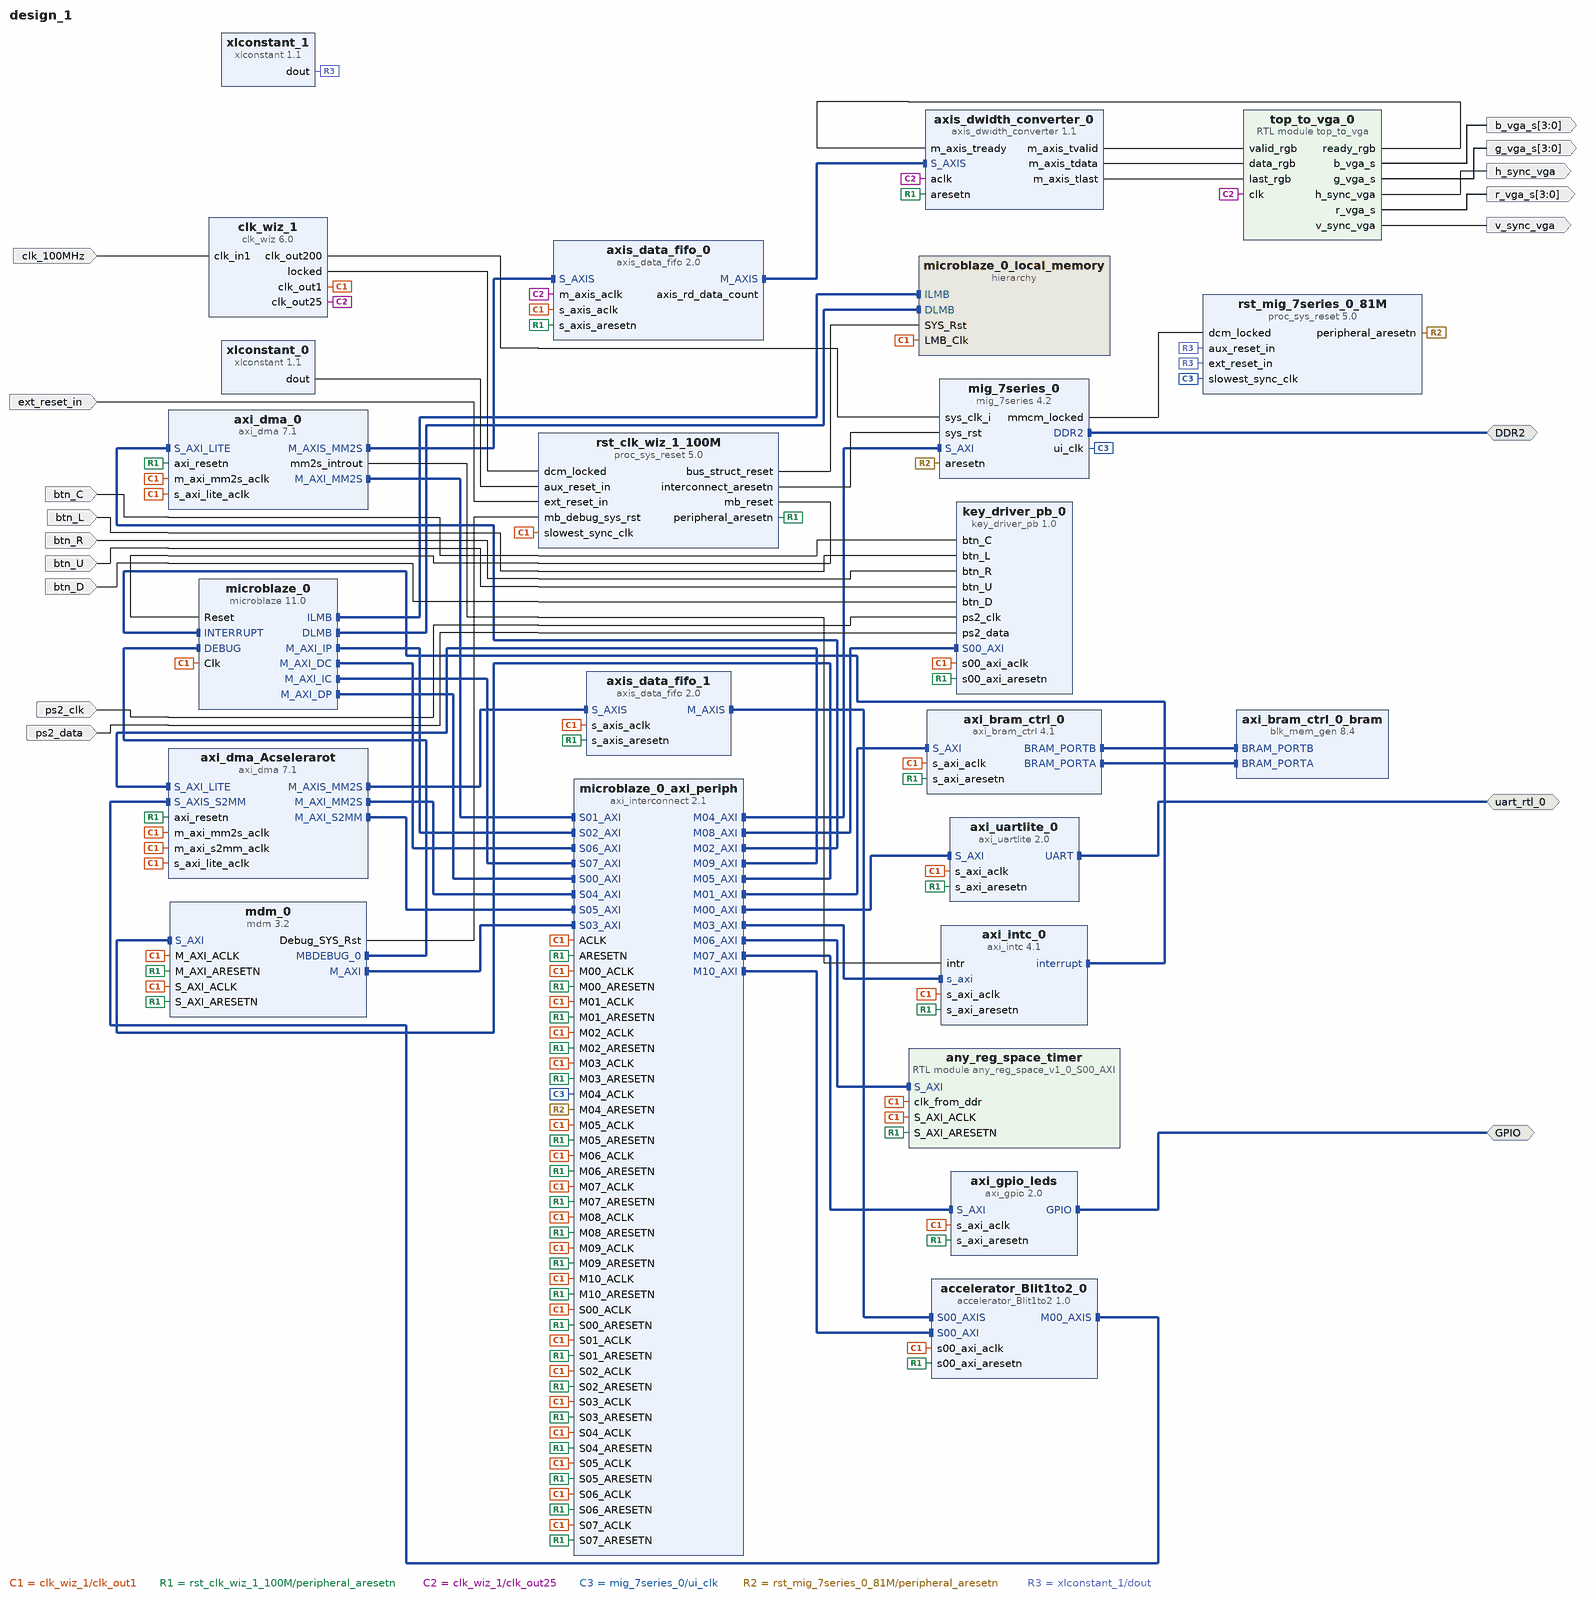
[diagram p0: block diagram of the top level]
# Vivado block design design_1, xc7a100tcsg324-1, Vivado 2019.1
create_bd_design design_1

create_bd_intf_port -mode Master -vlnv xilinx.com:interface:uart_rtl:1.0 uart_rtl_0
create_bd_intf_port -mode Master -vlnv xilinx.com:interface:ddrx_rtl:1.0 DDR2
create_bd_intf_port -mode Master -vlnv xilinx.com:interface:gpio_rtl:1.0 GPIO
create_bd_port -dir I -type clk clk_100MHz
set_property -dict {CONFIG.FREQ_HZ 100000000} [get_bd_ports clk_100MHz]
create_bd_port -dir O -from 3 -to 0 r_vga_s
create_bd_port -dir O -from 3 -to 0 g_vga_s
create_bd_port -dir O -from 3 -to 0 b_vga_s
create_bd_port -dir O v_sync_vga
create_bd_port -dir O h_sync_vga
create_bd_port -dir I -type rst ext_reset_in
create_bd_port -dir I btn_C
create_bd_port -dir I btn_L
create_bd_port -dir I btn_R
create_bd_port -dir I btn_U
create_bd_port -dir I btn_D
create_bd_port -dir I ps2_clk
create_bd_port -dir I ps2_data

create_bd_cell -type ip -vlnv xilinx.com:ip:microblaze:11.0 microblaze_0
set_property -dict [list \
  CONFIG.C_ADDR_TAG_BITS 15 \
  CONFIG.C_ALLOW_ICACHE_WR 1 \
  CONFIG.C_BRANCH_TARGET_CACHE_SIZE 0 \
  CONFIG.C_CACHE_BYTE_SIZE 4096 \
  CONFIG.C_DCACHE_ADDR_TAG 15 \
  CONFIG.C_DCACHE_BASEADDR 0x0000000080000000 \
  CONFIG.C_DCACHE_BYTE_SIZE 4096 \
  CONFIG.C_DCACHE_FORCE_TAG_LUTRAM 1 \
  CONFIG.C_DCACHE_HIGHADDR 0x0000000087FFFFFF \
  CONFIG.C_DCACHE_LINE_LEN 16 \
  CONFIG.C_DCACHE_USE_WRITEBACK 1 \
  CONFIG.C_DCACHE_VICTIMS 8 \
  CONFIG.C_DEBUG_ENABLED 1 \
  CONFIG.C_D_AXI 1 \
  CONFIG.C_D_LMB 1 \
  CONFIG.C_ICACHE_BASEADDR 0x0000000080000000 \
  CONFIG.C_ICACHE_FORCE_TAG_LUTRAM 1 \
  CONFIG.C_ICACHE_HIGHADDR 0x0000000087FFFFFF \
  CONFIG.C_ICACHE_LINE_LEN 16 \
  CONFIG.C_ICACHE_VICTIMS 8 \
  CONFIG.C_I_AXI 1 \
  CONFIG.C_I_LMB 1 \
  CONFIG.C_NUMBER_OF_PC_BRK 0 \
  CONFIG.C_USE_BARREL 1 \
  CONFIG.C_USE_BRANCH_TARGET_CACHE 0 \
  CONFIG.C_USE_DCACHE 1 \
  CONFIG.C_USE_DIV 1 \
  CONFIG.C_USE_FPU 1 \
  CONFIG.C_USE_HW_MUL 1 \
  CONFIG.C_USE_ICACHE 1 \
  CONFIG.C_USE_MSR_INSTR 1 \
  CONFIG.C_USE_PCMP_INSTR 1 \
] [get_bd_cells microblaze_0]
create_bd_cell -type hier microblaze_0_local_memory
create_bd_cell -type ip -vlnv xilinx.com:ip:clk_wiz:6.0 clk_wiz_1
set_property -dict [list \
  CONFIG.CLKOUT1_JITTER 145.728 \
  CONFIG.CLKOUT1_PHASE_ERROR 132.063 \
  CONFIG.CLKOUT1_REQUESTED_OUT_FREQ 120.000 \
  CONFIG.CLKOUT2_JITTER 200.470 \
  CONFIG.CLKOUT2_PHASE_ERROR 132.063 \
  CONFIG.CLKOUT2_REQUESTED_OUT_FREQ 25.000 \
  CONFIG.CLKOUT2_USED true \
  CONFIG.CLKOUT3_JITTER 132.221 \
  CONFIG.CLKOUT3_PHASE_ERROR 132.063 \
  CONFIG.CLKOUT3_REQUESTED_OUT_FREQ 200.000 \
  CONFIG.CLKOUT3_USED true \
  CONFIG.CLKOUT4_JITTER 151.366 \
  CONFIG.CLKOUT4_PHASE_ERROR 132.063 \
  CONFIG.CLKOUT4_USED true \
  CONFIG.CLK_OUT2_PORT clk_out25 \
  CONFIG.CLK_OUT3_PORT clk_out200 \
  CONFIG.CLK_OUT4_PORT clk_out100 \
  CONFIG.MMCM_CLKFBOUT_MULT_F 6.000 \
  CONFIG.MMCM_CLKIN1_PERIOD 10.0 \
  CONFIG.MMCM_CLKIN2_PERIOD 10.0 \
  CONFIG.MMCM_CLKOUT0_DIVIDE_F 5.000 \
  CONFIG.MMCM_CLKOUT1_DIVIDE 24 \
  CONFIG.MMCM_CLKOUT2_DIVIDE 3 \
  CONFIG.MMCM_CLKOUT3_DIVIDE 6 \
  CONFIG.NUM_OUT_CLKS 4 \
  CONFIG.PRIM_SOURCE Single_ended_clock_capable_pin \
  CONFIG.USE_LOCKED true \
  CONFIG.USE_RESET false \
] [get_bd_cells clk_wiz_1]
create_bd_cell -type ip -vlnv xilinx.com:ip:proc_sys_reset:5.0 rst_clk_wiz_1_100M
create_bd_cell -type ip -vlnv xilinx.com:ip:axi_uartlite:2.0 axi_uartlite_0
set_property -dict {CONFIG.C_BAUDRATE 115200} [get_bd_cells axi_uartlite_0]
create_bd_cell -type ip -vlnv xilinx.com:ip:axi_interconnect:2.1 microblaze_0_axi_periph
set_property -dict [list \
  CONFIG.ENABLE_ADVANCED_OPTIONS 1 \
  CONFIG.M00_HAS_DATA_FIFO 0 \
  CONFIG.NUM_MI 11 \
  CONFIG.NUM_SI 8 \
  CONFIG.S00_ARB_PRIORITY 1 \
  CONFIG.S00_HAS_DATA_FIFO 0 \
  CONFIG.S01_ARB_PRIORITY 3 \
  CONFIG.S02_ARB_PRIORITY 1 \
  CONFIG.S02_HAS_DATA_FIFO 0 \
  CONFIG.S06_ARB_PRIORITY 2 \
  CONFIG.S06_HAS_DATA_FIFO 2 \
  CONFIG.S07_HAS_DATA_FIFO 2 \
] [get_bd_cells microblaze_0_axi_periph]
create_bd_cell -type ip -vlnv xilinx.com:ip:xlconstant:1.1 xlconstant_0
create_bd_cell -type ip -vlnv xilinx.com:ip:axis_data_fifo:2.0 axis_data_fifo_0
set_property -dict [list \
  CONFIG.FIFO_DEPTH 1024 \
  CONFIG.FIFO_MEMORY_TYPE auto \
  CONFIG.HAS_RD_DATA_COUNT 1 \
  CONFIG.IS_ACLK_ASYNC 1 \
] [get_bd_cells axis_data_fifo_0]
create_bd_cell -type ip -vlnv xilinx.com:ip:axis_dwidth_converter:1.1 axis_dwidth_converter_0
set_property -dict {CONFIG.S_TDATA_NUM_BYTES 4} [get_bd_cells axis_dwidth_converter_0]
create_bd_cell -type ip -vlnv xilinx.com:ip:axi_dma:7.1 axi_dma_0
set_property -dict [list \
  CONFIG.c_include_mm2s_dre 1 \
  CONFIG.c_include_s2mm 0 \
  CONFIG.c_include_sg 0 \
  CONFIG.c_mm2s_burst_size 32 \
  CONFIG.c_sg_length_width 26 \
] [get_bd_cells axi_dma_0]
create_bd_cell -type ip -vlnv xilinx.com:ip:axi_bram_ctrl:4.1 axi_bram_ctrl_0
create_bd_cell -type ip -vlnv xilinx.com:ip:blk_mem_gen:8.4 axi_bram_ctrl_0_bram
set_property -dict [list \
  CONFIG.Enable_B Use_ENB_Pin \
  CONFIG.Memory_Type True_Dual_Port_RAM \
  CONFIG.Port_B_Clock 100 \
  CONFIG.Port_B_Enable_Rate 100 \
  CONFIG.Port_B_Write_Rate 50 \
  CONFIG.Use_RSTB_Pin true \
] [get_bd_cells axi_bram_ctrl_0_bram]
create_bd_cell -type ip -vlnv xilinx.com:ip:axi_intc:4.1 axi_intc_0
create_bd_cell -type ip -vlnv xilinx.com:ip:mig_7series:4.2 mig_7series_0
set_property -dict [list \
  CONFIG.BOARD_MIG_PARAM Custom \
  CONFIG.MIG_DONT_TOUCH_PARAM Custom \
  CONFIG.RESET_BOARD_INTERFACE Custom \
  CONFIG.XML_INPUT_FILE mig_b.prj \
] [get_bd_cells mig_7series_0]
create_bd_cell -type ip -vlnv xilinx.com:ip:proc_sys_reset:5.0 rst_mig_7series_0_81M
set_property -dict {CONFIG.C_AUX_RESET_HIGH 1} [get_bd_cells rst_mig_7series_0_81M]
create_bd_cell -type ip -vlnv xilinx.com:ip:xlconstant:1.1 xlconstant_1
set_property -dict {CONFIG.CONST_VAL 0} [get_bd_cells xlconstant_1]
create_bd_cell -type ip -vlnv xilinx.com:ip:mdm:3.2 mdm_0
set_property -dict [list \
  CONFIG.C_ADDR_SIZE 32 \
  CONFIG.C_DBG_MEM_ACCESS 1 \
  CONFIG.C_DBG_REG_ACCESS 1 \
  CONFIG.C_M_AXI_ADDR_WIDTH 32 \
  CONFIG.C_S_AXI_ADDR_WIDTH 5 \
  CONFIG.C_USE_CROSS_TRIGGER 0 \
  CONFIG.C_USE_UART 0 \
] [get_bd_cells mdm_0]
create_bd_cell -type ip -vlnv xilinx.com:ip:axi_gpio:2.0 axi_gpio_leds
set_property -dict {CONFIG.C_ALL_OUTPUTS 1 CONFIG.C_GPIO_WIDTH 4} [get_bd_cells axi_gpio_leds]
create_bd_cell -type module -reference top_to_vga top_to_vga_0
create_bd_cell -type ip -vlnv xilinx.com:ip:axi_dma:7.1 axi_dma_Acselerarot
set_property -dict [list \
  CONFIG.c_include_mm2s_dre 1 \
  CONFIG.c_include_s2mm_dre 1 \
  CONFIG.c_include_sg 0 \
  CONFIG.c_mm2s_burst_size 16 \
  CONFIG.c_s2mm_burst_size 16 \
  CONFIG.c_sg_length_width 26 \
] [get_bd_cells axi_dma_Acselerarot]
create_bd_cell -type ip -vlnv xilinx.com:ip:axis_data_fifo:2.0 axis_data_fifo_1
set_property -dict {CONFIG.FIFO_DEPTH 64 CONFIG.HAS_TLAST 1 CONFIG.TDATA_NUM_BYTES 4} [get_bd_cells axis_data_fifo_1]
create_bd_cell -type ip -vlnv xilinx.com:user:key_driver_pb:1.0 key_driver_pb_0
create_bd_cell -type ip -vlnv xilinx.com:user:accelerator_Blit1to2:1.0 accelerator_Blit1to2_0
create_bd_cell -type module -reference any_reg_space_v1_0_S00_AXI any_reg_space_timer
set_property -dict {CONFIG.DEVIDER_COUNTER 10} [get_bd_cells any_reg_space_timer]

# ---- hierarchy /microblaze_0_local_memory ----
current_bd_instance /microblaze_0_local_memory
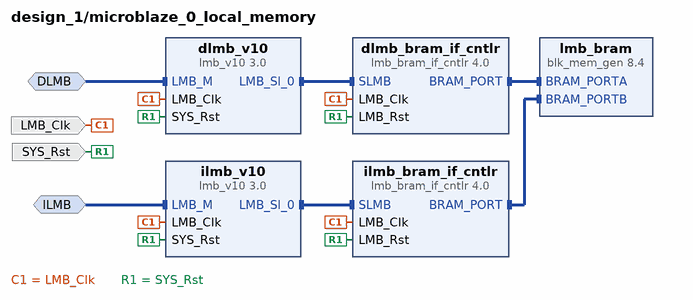
[diagram p1: block diagram inside /microblaze_0_local_memory]
create_bd_intf_pin -mode MirroredMaster -vlnv xilinx.com:interface:lmb_rtl:1.0 DLMB
create_bd_intf_pin -mode MirroredMaster -vlnv xilinx.com:interface:lmb_rtl:1.0 ILMB
create_bd_pin -dir I -type clk LMB_Clk
create_bd_pin -dir I -type rst SYS_Rst

create_bd_cell -type ip -vlnv xilinx.com:ip:lmb_v10:3.0 dlmb_v10
create_bd_cell -type ip -vlnv xilinx.com:ip:lmb_v10:3.0 ilmb_v10
create_bd_cell -type ip -vlnv xilinx.com:ip:lmb_bram_if_cntlr:4.0 dlmb_bram_if_cntlr
set_property -dict {CONFIG.C_ECC 0} [get_bd_cells dlmb_bram_if_cntlr]
create_bd_cell -type ip -vlnv xilinx.com:ip:lmb_bram_if_cntlr:4.0 ilmb_bram_if_cntlr
set_property -dict {CONFIG.C_ECC 0} [get_bd_cells ilmb_bram_if_cntlr]
create_bd_cell -type ip -vlnv xilinx.com:ip:blk_mem_gen:8.4 lmb_bram
set_property -dict {CONFIG.Memory_Type True_Dual_Port_RAM CONFIG.use_bram_block BRAM_Controller} [get_bd_cells lmb_bram]

# ---- connections ----

current_bd_instance /microblaze_0_local_memory
connect_bd_intf_net -intf_net microblaze_0_ilmb [get_bd_intf_pins ILMB] [get_bd_intf_pins ilmb_v10/LMB_M]
connect_bd_intf_net -intf_net microblaze_0_dlmb_cntlr [get_bd_intf_pins dlmb_bram_if_cntlr/BRAM_PORT] [get_bd_intf_pins lmb_bram/BRAM_PORTA]
connect_bd_intf_net -intf_net microblaze_0_ilmb_bus [get_bd_intf_pins ilmb_v10/LMB_Sl_0] [get_bd_intf_pins ilmb_bram_if_cntlr/SLMB]
connect_bd_intf_net -intf_net microblaze_0_dlmb [get_bd_intf_pins DLMB] [get_bd_intf_pins dlmb_v10/LMB_M]
connect_bd_intf_net -intf_net microblaze_0_ilmb_cntlr [get_bd_intf_pins ilmb_bram_if_cntlr/BRAM_PORT] [get_bd_intf_pins lmb_bram/BRAM_PORTB]
connect_bd_intf_net -intf_net microblaze_0_dlmb_bus [get_bd_intf_pins dlmb_v10/LMB_Sl_0] [get_bd_intf_pins dlmb_bram_if_cntlr/SLMB]
connect_bd_net -net microblaze_0_Clk [get_bd_pins LMB_Clk] \
  [get_bd_pins dlmb_v10/LMB_Clk] [get_bd_pins dlmb_bram_if_cntlr/LMB_Clk] [get_bd_pins ilmb_v10/LMB_Clk] \
  [get_bd_pins ilmb_bram_if_cntlr/LMB_Clk]
connect_bd_net [get_bd_pins SYS_Rst] \
  [get_bd_pins dlmb_v10/SYS_Rst] [get_bd_pins dlmb_bram_if_cntlr/LMB_Rst] [get_bd_pins ilmb_v10/SYS_Rst] \
  [get_bd_pins ilmb_bram_if_cntlr/LMB_Rst]
set_property HDL_ATTRIBUTE.BMM_INFO_ADDRESS_SPACE {byte  0x00000000 32 > design_1 microblaze_0_local_memory/lmb_bram} [get_bd_cells dlmb_bram_if_cntlr]
set_property HDL_ATTRIBUTE.KEEP_HIERARCHY yes [get_bd_cells dlmb_bram_if_cntlr]

current_bd_instance /
connect_bd_intf_net [get_bd_intf_ports DDR2] [get_bd_intf_pins mig_7series_0/DDR2]
connect_bd_intf_net [get_bd_intf_pins axis_data_fifo_0/M_AXIS] [get_bd_intf_pins axis_dwidth_converter_0/S_AXIS]
connect_bd_intf_net [get_bd_intf_pins axi_dma_Acselerarot/M_AXI_MM2S] [get_bd_intf_pins microblaze_0_axi_periph/S04_AXI]
connect_bd_intf_net [get_bd_intf_pins axi_dma_Acselerarot/M_AXI_S2MM] [get_bd_intf_pins microblaze_0_axi_periph/S05_AXI]
connect_bd_intf_net [get_bd_intf_pins microblaze_0/M_AXI_IP] [get_bd_intf_pins microblaze_0_axi_periph/S02_AXI]
connect_bd_intf_net [get_bd_intf_pins microblaze_0_axi_periph/M03_AXI] [get_bd_intf_pins axi_intc_0/s_axi]
connect_bd_intf_net -intf_net axi_dma_Acselerarot_M_AXIS_MM2S [get_bd_intf_pins axi_dma_Acselerarot/M_AXIS_MM2S] [get_bd_intf_pins axis_data_fifo_1/S_AXIS]
connect_bd_intf_net -intf_net accelerator_Blit1to2_0_M00_AXIS [get_bd_intf_pins accelerator_Blit1to2_0/M00_AXIS] [get_bd_intf_pins axi_dma_Acselerarot/S_AXIS_S2MM]
connect_bd_intf_net [get_bd_intf_pins microblaze_0_axi_periph/M06_AXI] [get_bd_intf_pins any_reg_space_timer/S_AXI]
connect_bd_intf_net [get_bd_intf_pins microblaze_0/ILMB] [get_bd_intf_pins microblaze_0_local_memory/ILMB]
connect_bd_intf_net [get_bd_intf_ports uart_rtl_0] [get_bd_intf_pins axi_uartlite_0/UART]
connect_bd_intf_net [get_bd_intf_pins axi_bram_ctrl_0/BRAM_PORTB] [get_bd_intf_pins axi_bram_ctrl_0_bram/BRAM_PORTB]
connect_bd_intf_net [get_bd_intf_pins accelerator_Blit1to2_0/S00_AXI] [get_bd_intf_pins microblaze_0_axi_periph/M10_AXI]
connect_bd_intf_net [get_bd_intf_pins axis_data_fifo_1/M_AXIS] [get_bd_intf_pins accelerator_Blit1to2_0/S00_AXIS]
connect_bd_intf_net [get_bd_intf_pins axi_intc_0/interrupt] [get_bd_intf_pins microblaze_0/INTERRUPT]
connect_bd_intf_net [get_bd_intf_pins microblaze_0_axi_periph/M07_AXI] [get_bd_intf_pins axi_gpio_leds/S_AXI]
connect_bd_intf_net [get_bd_intf_pins microblaze_0/M_AXI_DC] [get_bd_intf_pins microblaze_0_axi_periph/S06_AXI]
connect_bd_intf_net [get_bd_intf_pins axi_dma_Acselerarot/S_AXI_LITE] [get_bd_intf_pins microblaze_0_axi_periph/M09_AXI]
connect_bd_intf_net [get_bd_intf_pins microblaze_0_axi_periph/M00_AXI] [get_bd_intf_pins axi_uartlite_0/S_AXI]
connect_bd_intf_net [get_bd_intf_pins axi_dma_0/M_AXI_MM2S] [get_bd_intf_pins microblaze_0_axi_periph/S01_AXI]
connect_bd_intf_net [get_bd_intf_pins mdm_0/M_AXI] [get_bd_intf_pins microblaze_0_axi_periph/S03_AXI]
connect_bd_intf_net [get_bd_intf_pins microblaze_0/M_AXI_IC] [get_bd_intf_pins microblaze_0_axi_periph/S07_AXI]
connect_bd_intf_net [get_bd_intf_pins axi_bram_ctrl_0_bram/BRAM_PORTA] [get_bd_intf_pins axi_bram_ctrl_0/BRAM_PORTA]
connect_bd_intf_net [get_bd_intf_pins microblaze_0_axi_periph/M02_AXI] [get_bd_intf_pins axi_dma_0/S_AXI_LITE]
connect_bd_intf_net [get_bd_intf_pins microblaze_0/M_AXI_DP] [get_bd_intf_pins microblaze_0_axi_periph/S00_AXI]
connect_bd_intf_net [get_bd_intf_pins mdm_0/S_AXI] [get_bd_intf_pins microblaze_0_axi_periph/M05_AXI]
connect_bd_intf_net [get_bd_intf_pins axi_dma_0/M_AXIS_MM2S] [get_bd_intf_pins axis_data_fifo_0/S_AXIS]
connect_bd_intf_net [get_bd_intf_pins microblaze_0/DLMB] [get_bd_intf_pins microblaze_0_local_memory/DLMB]
connect_bd_intf_net -intf_net microblaze_0_axi_periph_M01_AXI [get_bd_intf_pins microblaze_0_axi_periph/M01_AXI] [get_bd_intf_pins axi_bram_ctrl_0/S_AXI]
connect_bd_intf_net [get_bd_intf_pins microblaze_0_axi_periph/M04_AXI] [get_bd_intf_pins mig_7series_0/S_AXI]
connect_bd_intf_net [get_bd_intf_pins mdm_0/MBDEBUG_0] [get_bd_intf_pins microblaze_0/DEBUG]
connect_bd_intf_net -intf_net axi_gpio_0_GPIO [get_bd_intf_ports GPIO] [get_bd_intf_pins axi_gpio_leds/GPIO]
connect_bd_intf_net [get_bd_intf_pins microblaze_0_axi_periph/M08_AXI] [get_bd_intf_pins key_driver_pb_0/S00_AXI]
connect_bd_net -net microblaze_0_Clk [get_bd_pins clk_wiz_1/clk_out1] \
  [get_bd_pins microblaze_0/Clk] [get_bd_pins microblaze_0_local_memory/LMB_Clk] \
  [get_bd_pins microblaze_0_axi_periph/S00_ACLK] [get_bd_pins microblaze_0_axi_periph/ACLK] \
  [get_bd_pins axi_intc_0/s_axi_aclk] [get_bd_pins microblaze_0_axi_periph/M03_ACLK] \
  [get_bd_pins microblaze_0_axi_periph/S02_ACLK] [get_bd_pins mdm_0/S_AXI_ACLK] [get_bd_pins mdm_0/M_AXI_ACLK] \
  [get_bd_pins microblaze_0_axi_periph/S03_ACLK] [get_bd_pins microblaze_0_axi_periph/M05_ACLK] \
  [get_bd_pins axi_dma_Acselerarot/s_axi_lite_aclk] [get_bd_pins axi_dma_Acselerarot/m_axi_mm2s_aclk] \
  [get_bd_pins microblaze_0_axi_periph/M09_ACLK] [get_bd_pins microblaze_0_axi_periph/S05_ACLK] \
  [get_bd_pins microblaze_0_axi_periph/S04_ACLK] [get_bd_pins axi_dma_Acselerarot/m_axi_s2mm_aclk] \
  [get_bd_pins microblaze_0_axi_periph/M10_ACLK] [get_bd_pins axis_data_fifo_1/s_axis_aclk] \
  [get_bd_pins microblaze_0_axi_periph/M00_ACLK] [get_bd_pins axi_uartlite_0/s_axi_aclk] \
  [get_bd_pins microblaze_0_axi_periph/M01_ACLK] [get_bd_pins axi_bram_ctrl_0/s_axi_aclk] \
  [get_bd_pins microblaze_0_axi_periph/M02_ACLK] [get_bd_pins microblaze_0_axi_periph/S01_ACLK] \
  [get_bd_pins axi_dma_0/s_axi_lite_aclk] [get_bd_pins axis_data_fifo_0/s_axis_aclk] [get_bd_pins axi_dma_0/m_axi_mm2s_aclk] \
  [get_bd_pins microblaze_0_axi_periph/M06_ACLK] [get_bd_pins microblaze_0_axi_periph/M07_ACLK] \
  [get_bd_pins axi_gpio_leds/s_axi_aclk] [get_bd_pins microblaze_0_axi_periph/M08_ACLK] \
  [get_bd_pins rst_clk_wiz_1_100M/slowest_sync_clk] [get_bd_pins key_driver_pb_0/s00_axi_aclk] \
  [get_bd_pins accelerator_Blit1to2_0/s00_axi_aclk] [get_bd_pins any_reg_space_timer/clk_from_ddr] \
  [get_bd_pins any_reg_space_timer/S_AXI_ACLK] [get_bd_pins microblaze_0_axi_periph/S06_ACLK] \
  [get_bd_pins microblaze_0_axi_periph/S07_ACLK]
connect_bd_net [get_bd_pins clk_wiz_1/locked] [get_bd_pins rst_clk_wiz_1_100M/dcm_locked]
connect_bd_net [get_bd_pins rst_clk_wiz_1_100M/mb_reset] [get_bd_pins microblaze_0/Reset]
connect_bd_net [get_bd_pins rst_clk_wiz_1_100M/bus_struct_reset] [get_bd_pins microblaze_0_local_memory/SYS_Rst]
connect_bd_net [get_bd_ports clk_100MHz] [get_bd_pins clk_wiz_1/clk_in1]
connect_bd_net [get_bd_pins rst_clk_wiz_1_100M/peripheral_aresetn] \
  [get_bd_pins microblaze_0_axi_periph/S00_ARESETN] [get_bd_pins axi_uartlite_0/s_axi_aresetn] \
  [get_bd_pins microblaze_0_axi_periph/M00_ARESETN] [get_bd_pins microblaze_0_axi_periph/ARESETN] \
  [get_bd_pins microblaze_0_axi_periph/M01_ARESETN] [get_bd_pins axis_dwidth_converter_0/aresetn] \
  [get_bd_pins axis_data_fifo_0/s_axis_aresetn] [get_bd_pins axi_dma_0/axi_resetn] \
  [get_bd_pins microblaze_0_axi_periph/M02_ARESETN] [get_bd_pins microblaze_0_axi_periph/S01_ARESETN] \
  [get_bd_pins axi_bram_ctrl_0/s_axi_aresetn] [get_bd_pins axi_intc_0/s_axi_aresetn] \
  [get_bd_pins microblaze_0_axi_periph/M03_ARESETN] [get_bd_pins microblaze_0_axi_periph/S02_ARESETN] \
  [get_bd_pins mdm_0/S_AXI_ARESETN] [get_bd_pins mdm_0/M_AXI_ARESETN] [get_bd_pins microblaze_0_axi_periph/S03_ARESETN] \
  [get_bd_pins microblaze_0_axi_periph/M05_ARESETN] [get_bd_pins microblaze_0_axi_periph/M06_ARESETN] \
  [get_bd_pins microblaze_0_axi_periph/M07_ARESETN] [get_bd_pins axi_gpio_leds/s_axi_aresetn] \
  [get_bd_pins microblaze_0_axi_periph/M08_ARESETN] [get_bd_pins microblaze_0_axi_periph/S05_ARESETN] \
  [get_bd_pins microblaze_0_axi_periph/S04_ARESETN] [get_bd_pins microblaze_0_axi_periph/M09_ARESETN] \
  [get_bd_pins axi_dma_Acselerarot/axi_resetn] [get_bd_pins microblaze_0_axi_periph/M10_ARESETN] \
  [get_bd_pins axis_data_fifo_1/s_axis_aresetn] [get_bd_pins key_driver_pb_0/s00_axi_aresetn] \
  [get_bd_pins accelerator_Blit1to2_0/s00_axi_aresetn] [get_bd_pins any_reg_space_timer/S_AXI_ARESETN] \
  [get_bd_pins microblaze_0_axi_periph/S06_ARESETN] [get_bd_pins microblaze_0_axi_periph/S07_ARESETN]
connect_bd_net [get_bd_pins xlconstant_0/dout] [get_bd_pins rst_clk_wiz_1_100M/aux_reset_in]
connect_bd_net [get_bd_pins clk_wiz_1/clk_out25] \
  [get_bd_pins axis_data_fifo_0/m_axis_aclk] [get_bd_pins axis_dwidth_converter_0/aclk] [get_bd_pins top_to_vga_0/clk]
connect_bd_net [get_bd_pins axis_dwidth_converter_0/m_axis_tvalid] [get_bd_pins top_to_vga_0/valid_rgb]
connect_bd_net [get_bd_pins top_to_vga_0/ready_rgb] [get_bd_pins axis_dwidth_converter_0/m_axis_tready]
connect_bd_net [get_bd_pins axis_dwidth_converter_0/m_axis_tdata] [get_bd_pins top_to_vga_0/data_rgb]
connect_bd_net [get_bd_pins top_to_vga_0/r_vga_s] [get_bd_ports r_vga_s]
connect_bd_net [get_bd_pins top_to_vga_0/g_vga_s] [get_bd_ports g_vga_s]
connect_bd_net [get_bd_pins top_to_vga_0/b_vga_s] [get_bd_ports b_vga_s]
connect_bd_net [get_bd_pins top_to_vga_0/v_sync_vga] [get_bd_ports v_sync_vga]
connect_bd_net [get_bd_pins top_to_vga_0/h_sync_vga] [get_bd_ports h_sync_vga]
connect_bd_net [get_bd_pins axi_dma_0/mm2s_introut] [get_bd_pins axi_intc_0/intr]
connect_bd_net [get_bd_pins clk_wiz_1/clk_out200] [get_bd_pins mig_7series_0/sys_clk_i]
connect_bd_net [get_bd_pins mig_7series_0/ui_clk] [get_bd_pins rst_mig_7series_0_81M/slowest_sync_clk] [get_bd_pins microblaze_0_axi_periph/M04_ACLK]
connect_bd_net [get_bd_pins mig_7series_0/mmcm_locked] [get_bd_pins rst_mig_7series_0_81M/dcm_locked]
connect_bd_net [get_bd_pins rst_mig_7series_0_81M/peripheral_aresetn] \
  [get_bd_pins mig_7series_0/aresetn] [get_bd_pins microblaze_0_axi_periph/M04_ARESETN]
connect_bd_net [get_bd_pins xlconstant_1/dout] [get_bd_pins rst_mig_7series_0_81M/ext_reset_in] [get_bd_pins rst_mig_7series_0_81M/aux_reset_in]
connect_bd_net [get_bd_pins rst_clk_wiz_1_100M/interconnect_aresetn] [get_bd_pins mig_7series_0/sys_rst]
connect_bd_net [get_bd_pins mdm_0/Debug_SYS_Rst] [get_bd_pins rst_clk_wiz_1_100M/mb_debug_sys_rst]
connect_bd_net [get_bd_pins axis_dwidth_converter_0/m_axis_tlast] [get_bd_pins top_to_vga_0/last_rgb]
connect_bd_net [get_bd_ports ext_reset_in] [get_bd_pins rst_clk_wiz_1_100M/ext_reset_in]
connect_bd_net [get_bd_ports btn_C] [get_bd_pins key_driver_pb_0/btn_C]
connect_bd_net [get_bd_ports btn_L] [get_bd_pins key_driver_pb_0/btn_L]
connect_bd_net [get_bd_ports btn_R] [get_bd_pins key_driver_pb_0/btn_R]
connect_bd_net [get_bd_ports btn_U] [get_bd_pins key_driver_pb_0/btn_U]
connect_bd_net [get_bd_ports btn_D] [get_bd_pins key_driver_pb_0/btn_D]
connect_bd_net [get_bd_ports ps2_clk] [get_bd_pins key_driver_pb_0/ps2_clk]
connect_bd_net [get_bd_ports ps2_data] [get_bd_pins key_driver_pb_0/ps2_data]
# net axis_rd_data_count has one end: axis_data_fifo_0/axis_rd_data_count
set_property HDL_ATTRIBUTE.BMM_INFO_PROCESSOR {microblaze-le > design_1 microblaze_0_local_memory/dlmb_bram_if_cntlr design_1 axi_bram_ctrl_0} [get_bd_cells microblaze_0]
set_property HDL_ATTRIBUTE.KEEP_HIERARCHY yes [get_bd_cells microblaze_0]
set_property HDL_ATTRIBUTE.BMM_INFO_ADDRESS_SPACE {byte  0xC0000000 32 > design_1 axi_bram_ctrl_0_bram} [get_bd_cells axi_bram_ctrl_0]
set_property HDL_ATTRIBUTE.KEEP_HIERARCHY yes [get_bd_cells axi_bram_ctrl_0]
set_property HDL_ATTRIBUTE.DEBUG true [get_bd_intf_nets axi_dma_Acselerarot_M_AXIS_MM2S]
set_property HDL_ATTRIBUTE.MARK_DEBUG true [get_bd_intf_nets axi_dma_Acselerarot_M_AXIS_MM2S]
set_property HDL_ATTRIBUTE.DEBUG true [get_bd_intf_nets accelerator_Blit1to2_0_M00_AXIS]
set_property HDL_ATTRIBUTE.MARK_DEBUG true [get_bd_intf_nets accelerator_Blit1to2_0_M00_AXIS]
set_property HDL_ATTRIBUTE.DEBUG true [get_bd_intf_nets microblaze_0_axi_periph_M01_AXI]
set_property HDL_ATTRIBUTE.MARK_DEBUG true [get_bd_intf_nets microblaze_0_axi_periph_M01_AXI]
set_property HDL_ATTRIBUTE.DEBUG true [get_bd_nets axis_rd_data_count]
set_property HDL_ATTRIBUTE.MARK_DEBUG true [get_bd_nets axis_rd_data_count]

# ---- address map ----
assign_bd_address -offset 0x80000000 -range 128M -target_address_space [get_bd_addr_spaces axi_dma_0/Data_MM2S] [get_bd_addr_segs mig_7series_0/memmap/memaddr]
assign_bd_address -offset 0xC0000000 -range 4K -target_address_space [get_bd_addr_spaces axi_dma_0/Data_MM2S] [get_bd_addr_segs axi_bram_ctrl_0/S_AXI/Mem0]
exclude_bd_addr_seg -offset 0x40000000 -range 64K -target_address_space [get_bd_addr_spaces axi_dma_0/Data_MM2S] [get_bd_addr_segs axi_gpio_leds/S_AXI/Reg]
exclude_bd_addr_seg -offset 0x40600000 -range 64K -target_address_space [get_bd_addr_spaces axi_dma_0/Data_MM2S] [get_bd_addr_segs axi_uartlite_0/S_AXI/Reg]
exclude_bd_addr_seg -offset 0x41200000 -range 64K -target_address_space [get_bd_addr_spaces axi_dma_0/Data_MM2S] [get_bd_addr_segs axi_intc_0/S_AXI/Reg]
exclude_bd_addr_seg -offset 0x41E00000 -range 64K -target_address_space [get_bd_addr_spaces axi_dma_0/Data_MM2S] [get_bd_addr_segs axi_dma_0/S_AXI_LITE/Reg]
exclude_bd_addr_seg -offset 0x41E10000 -range 64K -target_address_space [get_bd_addr_spaces axi_dma_0/Data_MM2S] [get_bd_addr_segs axi_dma_Acselerarot/S_AXI_LITE/Reg]
exclude_bd_addr_seg -offset 0x44A00000 -range 64K -target_address_space [get_bd_addr_spaces axi_dma_0/Data_MM2S] [get_bd_addr_segs any_reg_space_timer/S_AXI/reg0]
exclude_bd_addr_seg -offset 0x44A10000 -range 64K -target_address_space [get_bd_addr_spaces axi_dma_0/Data_MM2S] [get_bd_addr_segs key_driver_pb_0/S00_AXI/S00_AXI_reg]
exclude_bd_addr_seg -offset 0x44A20000 -range 64K -target_address_space [get_bd_addr_spaces axi_dma_0/Data_MM2S] [get_bd_addr_segs accelerator_Blit1to2_0/S00_AXI/S00_AXI_reg]
assign_bd_address -offset 0x80000000 -range 128M -target_address_space [get_bd_addr_spaces axi_dma_Acselerarot/Data_MM2S] [get_bd_addr_segs mig_7series_0/memmap/memaddr]
assign_bd_address -offset 0xC0000000 -range 4K -target_address_space [get_bd_addr_spaces axi_dma_Acselerarot/Data_MM2S] [get_bd_addr_segs axi_bram_ctrl_0/S_AXI/Mem0]
exclude_bd_addr_seg -offset 0x40000000 -range 64K -target_address_space [get_bd_addr_spaces axi_dma_Acselerarot/Data_MM2S] [get_bd_addr_segs axi_gpio_leds/S_AXI/Reg]
exclude_bd_addr_seg -offset 0x40600000 -range 64K -target_address_space [get_bd_addr_spaces axi_dma_Acselerarot/Data_MM2S] [get_bd_addr_segs axi_uartlite_0/S_AXI/Reg]
exclude_bd_addr_seg -offset 0x41200000 -range 64K -target_address_space [get_bd_addr_spaces axi_dma_Acselerarot/Data_MM2S] [get_bd_addr_segs axi_intc_0/S_AXI/Reg]
exclude_bd_addr_seg -offset 0x41400000 -range 4K -target_address_space [get_bd_addr_spaces axi_dma_Acselerarot/Data_MM2S] [get_bd_addr_segs mdm_0/S_AXI/Reg]
exclude_bd_addr_seg -offset 0x41E00000 -range 64K -target_address_space [get_bd_addr_spaces axi_dma_Acselerarot/Data_MM2S] [get_bd_addr_segs axi_dma_0/S_AXI_LITE/Reg]
exclude_bd_addr_seg -offset 0x41E10000 -range 64K -target_address_space [get_bd_addr_spaces axi_dma_Acselerarot/Data_MM2S] [get_bd_addr_segs axi_dma_Acselerarot/S_AXI_LITE/Reg]
exclude_bd_addr_seg -offset 0x44A00000 -range 64K -target_address_space [get_bd_addr_spaces axi_dma_Acselerarot/Data_MM2S] [get_bd_addr_segs any_reg_space_timer/S_AXI/reg0]
exclude_bd_addr_seg -offset 0x44A10000 -range 64K -target_address_space [get_bd_addr_spaces axi_dma_Acselerarot/Data_MM2S] [get_bd_addr_segs key_driver_pb_0/S00_AXI/S00_AXI_reg]
exclude_bd_addr_seg -offset 0x44A20000 -range 64K -target_address_space [get_bd_addr_spaces axi_dma_Acselerarot/Data_MM2S] [get_bd_addr_segs accelerator_Blit1to2_0/S00_AXI/S00_AXI_reg]
assign_bd_address -offset 0x80000000 -range 128M -target_address_space [get_bd_addr_spaces axi_dma_Acselerarot/Data_S2MM] [get_bd_addr_segs mig_7series_0/memmap/memaddr]
assign_bd_address -offset 0xC0000000 -range 4K -target_address_space [get_bd_addr_spaces axi_dma_Acselerarot/Data_S2MM] [get_bd_addr_segs axi_bram_ctrl_0/S_AXI/Mem0]
exclude_bd_addr_seg -offset 0x40000000 -range 64K -target_address_space [get_bd_addr_spaces axi_dma_Acselerarot/Data_S2MM] [get_bd_addr_segs axi_gpio_leds/S_AXI/Reg]
exclude_bd_addr_seg -offset 0x40600000 -range 64K -target_address_space [get_bd_addr_spaces axi_dma_Acselerarot/Data_S2MM] [get_bd_addr_segs axi_uartlite_0/S_AXI/Reg]
exclude_bd_addr_seg -offset 0x41200000 -range 64K -target_address_space [get_bd_addr_spaces axi_dma_Acselerarot/Data_S2MM] [get_bd_addr_segs axi_intc_0/S_AXI/Reg]
exclude_bd_addr_seg -offset 0x41400000 -range 4K -target_address_space [get_bd_addr_spaces axi_dma_Acselerarot/Data_S2MM] [get_bd_addr_segs mdm_0/S_AXI/Reg]
exclude_bd_addr_seg -offset 0x41E00000 -range 64K -target_address_space [get_bd_addr_spaces axi_dma_Acselerarot/Data_S2MM] [get_bd_addr_segs axi_dma_0/S_AXI_LITE/Reg]
exclude_bd_addr_seg -offset 0x41E10000 -range 64K -target_address_space [get_bd_addr_spaces axi_dma_Acselerarot/Data_S2MM] [get_bd_addr_segs axi_dma_Acselerarot/S_AXI_LITE/Reg]
exclude_bd_addr_seg -offset 0x44A00000 -range 64K -target_address_space [get_bd_addr_spaces axi_dma_Acselerarot/Data_S2MM] [get_bd_addr_segs any_reg_space_timer/S_AXI/reg0]
exclude_bd_addr_seg -offset 0x44A10000 -range 64K -target_address_space [get_bd_addr_spaces axi_dma_Acselerarot/Data_S2MM] [get_bd_addr_segs key_driver_pb_0/S00_AXI/S00_AXI_reg]
exclude_bd_addr_seg -offset 0x44A20000 -range 64K -target_address_space [get_bd_addr_spaces axi_dma_Acselerarot/Data_S2MM] [get_bd_addr_segs accelerator_Blit1to2_0/S00_AXI/S00_AXI_reg]
assign_bd_address -offset 0x40000000 -range 64K -target_address_space [get_bd_addr_spaces mdm_0/Data] [get_bd_addr_segs axi_gpio_leds/S_AXI/Reg]
assign_bd_address -offset 0x40600000 -range 64K -target_address_space [get_bd_addr_spaces mdm_0/Data] [get_bd_addr_segs axi_uartlite_0/S_AXI/Reg]
assign_bd_address -offset 0x41200000 -range 64K -target_address_space [get_bd_addr_spaces mdm_0/Data] [get_bd_addr_segs axi_intc_0/S_AXI/Reg]
assign_bd_address -offset 0x41400000 -range 4K -target_address_space [get_bd_addr_spaces mdm_0/Data] [get_bd_addr_segs mdm_0/S_AXI/Reg]
assign_bd_address -offset 0x41E00000 -range 64K -target_address_space [get_bd_addr_spaces mdm_0/Data] [get_bd_addr_segs axi_dma_0/S_AXI_LITE/Reg]
assign_bd_address -offset 0x41E10000 -range 64K -target_address_space [get_bd_addr_spaces mdm_0/Data] [get_bd_addr_segs axi_dma_Acselerarot/S_AXI_LITE/Reg]
assign_bd_address -offset 0x44A00000 -range 64K -target_address_space [get_bd_addr_spaces mdm_0/Data] [get_bd_addr_segs any_reg_space_timer/S_AXI/reg0]
assign_bd_address -offset 0x44A10000 -range 64K -target_address_space [get_bd_addr_spaces mdm_0/Data] [get_bd_addr_segs key_driver_pb_0/S00_AXI/S00_AXI_reg]
assign_bd_address -offset 0x44A20000 -range 64K -target_address_space [get_bd_addr_spaces mdm_0/Data] [get_bd_addr_segs accelerator_Blit1to2_0/S00_AXI/S00_AXI_reg]
assign_bd_address -offset 0x80000000 -range 128M -target_address_space [get_bd_addr_spaces mdm_0/Data] [get_bd_addr_segs mig_7series_0/memmap/memaddr]
assign_bd_address -offset 0x00000000 -range 4K -target_address_space [get_bd_addr_spaces microblaze_0/Data] [get_bd_addr_segs microblaze_0_local_memory/dlmb_bram_if_cntlr/SLMB/Mem]
assign_bd_address -offset 0x40000000 -range 64K -target_address_space [get_bd_addr_spaces microblaze_0/Data] [get_bd_addr_segs axi_gpio_leds/S_AXI/Reg]
assign_bd_address -offset 0x40600000 -range 64K -target_address_space [get_bd_addr_spaces microblaze_0/Data] [get_bd_addr_segs axi_uartlite_0/S_AXI/Reg]
assign_bd_address -offset 0x41200000 -range 64K -target_address_space [get_bd_addr_spaces microblaze_0/Data] [get_bd_addr_segs axi_intc_0/S_AXI/Reg]
assign_bd_address -offset 0x41400000 -range 4K -target_address_space [get_bd_addr_spaces microblaze_0/Data] [get_bd_addr_segs mdm_0/S_AXI/Reg]
assign_bd_address -offset 0x41E00000 -range 64K -target_address_space [get_bd_addr_spaces microblaze_0/Data] [get_bd_addr_segs axi_dma_0/S_AXI_LITE/Reg]
assign_bd_address -offset 0x41E10000 -range 64K -target_address_space [get_bd_addr_spaces microblaze_0/Data] [get_bd_addr_segs axi_dma_Acselerarot/S_AXI_LITE/Reg]
assign_bd_address -offset 0x44A00000 -range 64K -target_address_space [get_bd_addr_spaces microblaze_0/Data] [get_bd_addr_segs any_reg_space_timer/S_AXI/reg0]
assign_bd_address -offset 0x44A10000 -range 64K -target_address_space [get_bd_addr_spaces microblaze_0/Data] [get_bd_addr_segs key_driver_pb_0/S00_AXI/S00_AXI_reg]
assign_bd_address -offset 0x44A20000 -range 64K -target_address_space [get_bd_addr_spaces microblaze_0/Data] [get_bd_addr_segs accelerator_Blit1to2_0/S00_AXI/S00_AXI_reg]
assign_bd_address -offset 0x80000000 -range 128M -target_address_space [get_bd_addr_spaces microblaze_0/Data] [get_bd_addr_segs mig_7series_0/memmap/memaddr]
assign_bd_address -offset 0xC0000000 -range 4K -target_address_space [get_bd_addr_spaces microblaze_0/Data] [get_bd_addr_segs axi_bram_ctrl_0/S_AXI/Mem0]
assign_bd_address -offset 0x00000000 -range 4K -target_address_space [get_bd_addr_spaces microblaze_0/Instruction] [get_bd_addr_segs microblaze_0_local_memory/ilmb_bram_if_cntlr/SLMB/Mem]
assign_bd_address -offset 0x40000000 -range 64K -target_address_space [get_bd_addr_spaces microblaze_0/Instruction] [get_bd_addr_segs axi_gpio_leds/S_AXI/Reg]
assign_bd_address -offset 0x40600000 -range 64K -target_address_space [get_bd_addr_spaces microblaze_0/Instruction] [get_bd_addr_segs axi_uartlite_0/S_AXI/Reg]
assign_bd_address -offset 0x41200000 -range 64K -target_address_space [get_bd_addr_spaces microblaze_0/Instruction] [get_bd_addr_segs axi_intc_0/S_AXI/Reg]
assign_bd_address -offset 0x41400000 -range 4K -target_address_space [get_bd_addr_spaces microblaze_0/Instruction] [get_bd_addr_segs mdm_0/S_AXI/Reg]
assign_bd_address -offset 0x41E00000 -range 64K -target_address_space [get_bd_addr_spaces microblaze_0/Instruction] [get_bd_addr_segs axi_dma_0/S_AXI_LITE/Reg]
assign_bd_address -offset 0x41E10000 -range 64K -target_address_space [get_bd_addr_spaces microblaze_0/Instruction] [get_bd_addr_segs axi_dma_Acselerarot/S_AXI_LITE/Reg]
assign_bd_address -offset 0x44A00000 -range 64K -target_address_space [get_bd_addr_spaces microblaze_0/Instruction] [get_bd_addr_segs any_reg_space_timer/S_AXI/reg0]
assign_bd_address -offset 0x44A10000 -range 64K -target_address_space [get_bd_addr_spaces microblaze_0/Instruction] [get_bd_addr_segs key_driver_pb_0/S00_AXI/S00_AXI_reg]
assign_bd_address -offset 0x44A20000 -range 64K -target_address_space [get_bd_addr_spaces microblaze_0/Instruction] [get_bd_addr_segs accelerator_Blit1to2_0/S00_AXI/S00_AXI_reg]
assign_bd_address -offset 0x80000000 -range 128M -target_address_space [get_bd_addr_spaces microblaze_0/Instruction] [get_bd_addr_segs mig_7series_0/memmap/memaddr]
assign_bd_address -offset 0xC0000000 -range 4K -target_address_space [get_bd_addr_spaces microblaze_0/Instruction] [get_bd_addr_segs axi_bram_ctrl_0/S_AXI/Mem0]

validate_bd_design
save_bd_design
